# Altium schematic sheet Sheet1.SchDoc
size A4
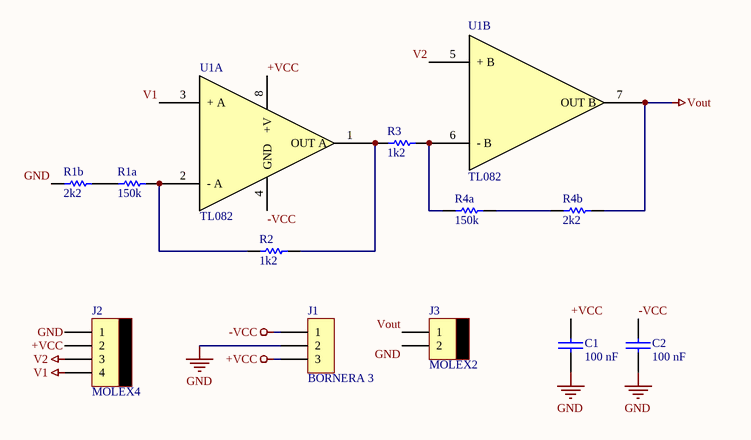
[diagram p0: Sheet1.SchDoc]

## Parts
C1  100 nF  [CAP100]
C2  100 nF  [CAP100]
J1  BORNERA 3  [BORNERA3]
J2  MOLEX4  [MOLEX4]
J3  MOLEX2  [MOLEX2]
R1a  150k  [RES400]
R1b  2k2  [0805]
R2  1k2  [0805]
R3  1k2  [0805]
R4a  150k  [0805]
R4b  2k2  [0805]
U1  TL082  [DIP8]  (parts A,B of 2)

## Nets
+VCC: C1.1 J1.3 J2.2 U1.8(+V)
-VCC: C2.1 J1.1 U1.4(GND)
GND: C1.2 C2.2 J1.2 J2.1 J3.2 R1b.1
V1: J2.4 U1.3(+_A)
V2: J2.3 U1.5(+_B)
Vout: J3.1 R4b.2 U1.7(OUT_B)
NetR1a_1: R1a.1 R1b.2
NetR1a_2: R1a.2 R2.1 U1.2(-_A)
NetR2_2: R2.2 R3.1 U1.1(OUT_A)
NetR3_2: R3.2 R4a.1 U1.6(-_B)
NetR4a_2: R4a.2 R4b.1

## Library data of the parts
C1 C2 = CAP
R1a R1b R2 R3 R4a R4b = RES
U1 = LM833: Dual Audio Operational Amplifier